# Altium schematic sheet STM32F429_minimum_system.SchDoc: STM32F429_minimum_system
size A3; Date: 2018/10/8; Author: WangPeirong; Revision: V1.1; SheetNumber: 2; SheetTotal: STM32F429IGT6 minimun system schdoc; Size: A3; Pages: 6
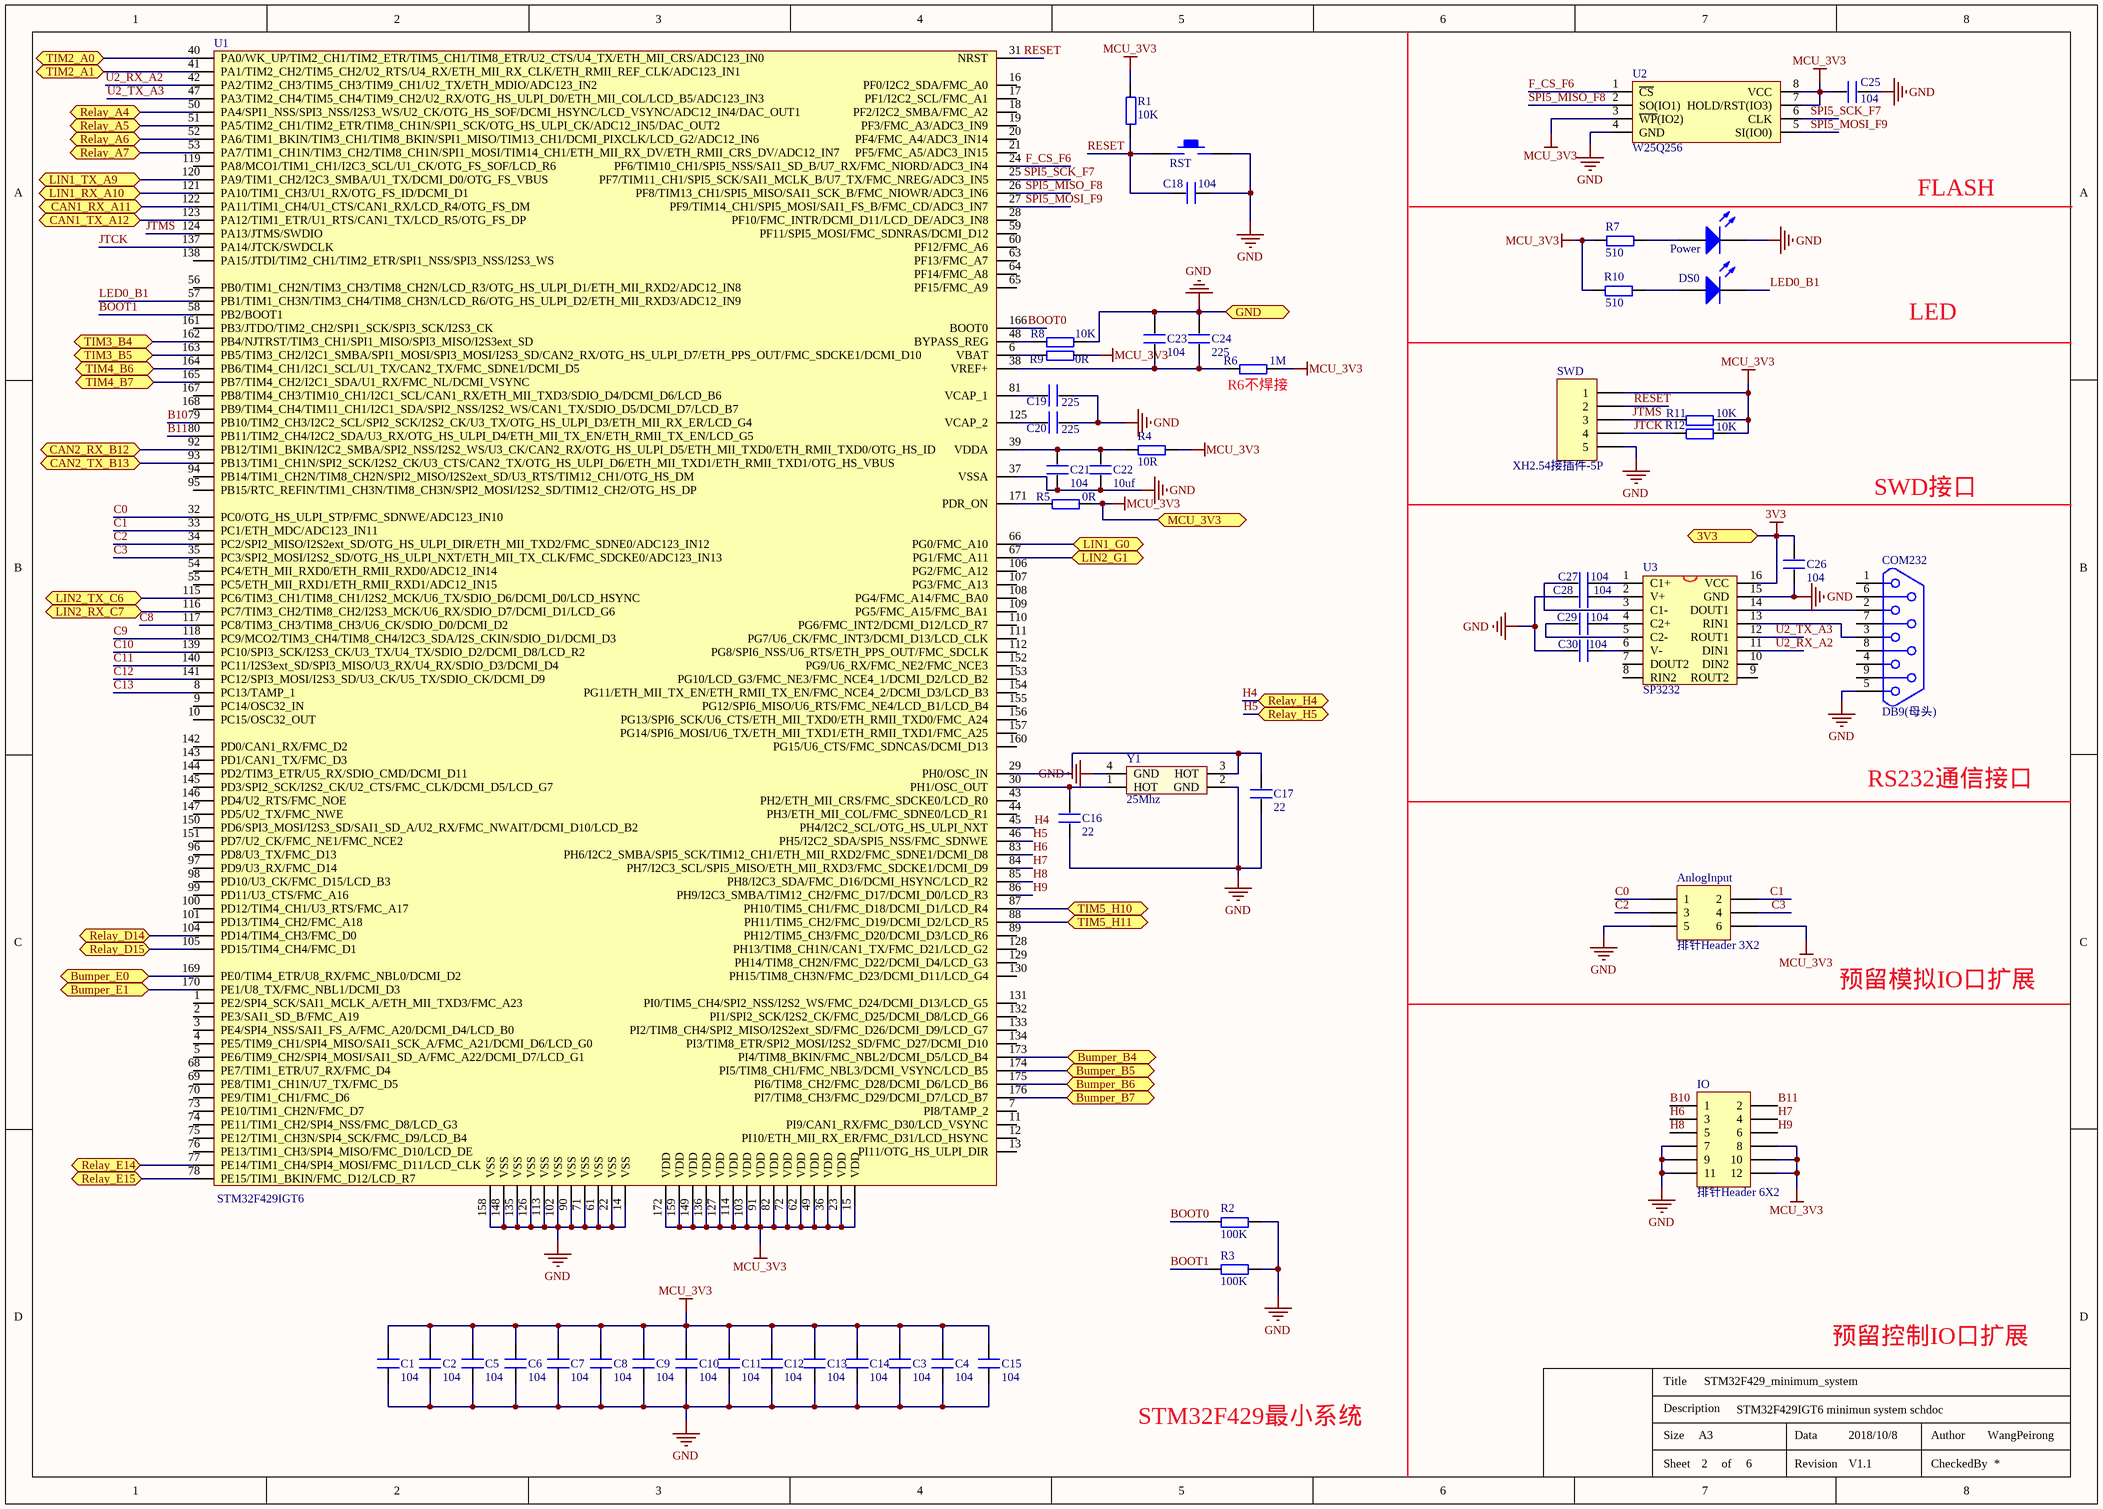
[diagram p0: STM32F429_minimum_system.SchDoc]

## Parts
AnlogInput  排针Header 3X2  [F-HEADER-2*3-2.54MM]
C1  104  [0603P]
C2  104  [0603P]
C3  104  [0603P]
C4  104  [0603P]
C5  104  [0603P]
C6  104  [0603P]
C7  104  [0603P]
C8  104  [0603P]
C9  104  [0603P]
C10  104  [0603P]
C11  104  [0603P]
C12  104  [0603P]
C13  104  [0603P]
C14  104  [0603P]
C15  104  [0603P]
C16  22  [0603P]
C17  22  [0603P]
C18  104  [0603P]
C19  225  [0603P]
C20  225  [0603P]
C21  104  [0603P]
C22  10uf  [0603P]
C23  104  [0603P]
C24  225  [0603P]
C25  104  [0603P]
C26  104  [0603P]
C27  104  [0603P]
C28  104  [0603P]
C29  104  [0603P]
C30  104  [0603P]
COM232  DB9(母头)  [DB9]
DS0  LED绿色  [SMDLED]  (value not drawn)
IO  排针Header 6X2  [F-HEADER-2*6-2.54MM]
Power  LED红色  [SMDLED]  (value not drawn)
R1  10K  [0603P]
R2  100K  [0603P]
R3  100K  [0603P]
R4  10R  [0603P]
R5  0R  [0603P]
R6  1M  [0603P]
R7  510  [0603P]
R8  10K  [0603P]
R9  0R  [0603P]
R10  510  [0603P]
R11  10K  [0603P]
R12  10K  [0603P]
RST  KEY_M  [KEY_SOP3625]  (value not drawn)
SWD  XH2.54接插件-5P  [F-HEADER-5-2.54MM]
U1  STM32F429IGT6  [LQFP176]
U2  W25Q256  [WSON8]
U3  SP3232  [SOP16M]
Y1  25Mhz  [XTAL3225]

## Ports
3V3, Bumper_B4, Bumper_B5, Bumper_B6, Bumper_B7, Bumper_E0, Bumper_E1, CAN1_RX_A11, CAN1_TX_A12, CAN2_RX_B12, CAN2_TX_B13, GND, LIN1_G0, LIN1_RX_A10, LIN1_TX_A9, LIN2_G1, LIN2_RX_C7, LIN2_TX_C6, MCU_3V3, Relay_A4, Relay_A5, Relay_A6, Relay_A7, Relay_D14, Relay_D15, Relay_E14, Relay_E15, Relay_H4, Relay_H5, TIM2_A0, TIM2_A1, TIM3_B4, TIM3_B5, TIM4_B6, TIM4_B7, TIM5_H10, TIM5_H11

## Nets
3V3: C26.2 U3.16(VCC) ; port 3V3
GND: AnlogInput.5 C1.1 C2.1 C3.1 C4.1 C5.1 C6.1 C7.1 C8.1 C9.1 C10.1 C11.1 C12.1 C13.1 C14.1 C15.1 C16.2 C17.2 C18.2 C19.2 C20.2 C21.1 C22.1 C23.2 C24.2 C25.2 C26.1 C28.2 C30.2 COM232.5 IO.7 IO.9 IO.11 Power.2(K) R2.2 R3.2 R8.2 RST.2 SWD.5 U1.14(VSS) U1.22(VSS) U1.37(VSSA) U1.61(VSS) U1.71(VSS) U1.90(VSS) U1.102(VSS) U1.113(VSS) U1.126(VSS) U1.135(VSS) U1.148(VSS) U1.158(VSS) U2.4(GND) U3.15(GND) Y1.2(GND) Y1.4(GND) ; port GND
MCU_3V3: AnlogInput.6 C1.2 C2.2 C3.2 C4.2 C5.2 C6.2 C7.2 C8.2 C9.2 C10.2 C11.2 C12.2 C13.2 C14.2 C15.2 C25.1 IO.8 IO.10 IO.12 R1.2 R4.2 R5.2 R6.2 R7.1 R9.2 R10.1 R11.2 R12.2 SWD.1 U1.15(VDD) U1.23(VDD) U1.36(VDD) U1.49(VDD) U1.62(VDD) U1.72(VDD) U1.82(VDD) U1.91(VDD) U1.103(VDD) U1.114(VDD) U1.127(VDD) U1.136(VDD) U1.149(VDD) U1.159(VDD) U1.172(VDD) U2.3(~{WP}(IO2)) U2.7(HOLD/RST(IO3)) U2.8(VCC) ; port MCU_3V3
B10: IO.1 U1.79(PB10/TIM2_CH3/I2C2_SCL/SPI2_SCK/I2S2_CK/U3_TX/OTG_HS_ULPI_D3/ETH_MII_RX_ER/LCD_G4)
B11: IO.2 U1.80(PB11/TIM2_CH4/I2C2_SDA/U3_RX/OTG_HS_ULPI_D4/ETH_MII_TX_EN/ETH_RMII_TX_EN/LCD_G5)
BOOT0: R2.1 U1.166(BOOT0)
BOOT1: R3.1 U1.58(PB2/BOOT1)
Bumper_B4: U1.173(PI4/TIM8_BKIN/FMC_NBL2/DCMI_D5/LCD_B4) ; port Bumper_B4
Bumper_B5: U1.174(PI5/TIM8_CH1/FMC_NBL3/DCMI_VSYNC/LCD_B5) ; port Bumper_B5
Bumper_B6: U1.175(PI6/TIM8_CH2/FMC_D28/DCMI_D6/LCD_B6) ; port Bumper_B6
Bumper_B7: U1.176(PI7/TIM8_CH3/FMC_D29/DCMI_D7/LCD_B7) ; port Bumper_B7
Bumper_E0: U1.169(PE0/TIM4_ETR/U8_RX/FMC_NBL0/DCMI_D2) ; port Bumper_E0
Bumper_E1: U1.170(PE1/U8_TX/FMC_NBL1/DCMI_D3) ; port Bumper_E1
C0: AnlogInput.1 U1.32(PC0/OTG_HS_ULPI_STP/FMC_SDNWE/ADC123_IN10)
C1: AnlogInput.2 U1.33(PC1/ETH_MDC/ADC123_IN11)
C2: AnlogInput.3 U1.34(PC2/SPI2_MISO/I2S2ext_SD/OTG_HS_ULPI_DIR/ETH_MII_TXD2/FMC_SDNE0/ADC123_IN12)
C3: AnlogInput.4 U1.35(PC3/SPI2_MOSI/I2S2_SD/OTG_HS_ULPI_NXT/ETH_MII_TX_CLK/FMC_SDCKE0/ADC123_IN13)
C8: U1.117(PC8/TIM3_CH3/TIM8_CH3/U6_CK/SDIO_D0/DCMI_D2)
C9: U1.118(PC9/MCO2/TIM3_CH4/TIM8_CH4/I2C3_SDA/I2S_CKIN/SDIO_D1/DCMI_D3)
C10: U1.139(PC10/SPI3_SCK/I2S3_CK/U3_TX/U4_TX/SDIO_D2/DCMI_D8/LCD_R2)
C11: U1.140(PC11/I2S3ext_SD/SPI3_MISO/U3_RX/U4_RX/SDIO_D3/DCMI_D4)
C12: U1.141(PC12/SPI3_MOSI/I2S3_SD/U3_CK/U5_TX/SDIO_CK/DCMI_D9)
C13: U1.8(PC13/TAMP_1)
CAN1_RX_A11: U1.122(PA11/TIM1_CH4/U1_CTS/CAN1_RX/LCD_R4/OTG_FS_DM) ; port CAN1_RX_A11
CAN1_TX_A12: U1.123(PA12/TIM1_ETR/U1_RTS/CAN1_TX/LCD_R5/OTG_FS_DP) ; port CAN1_TX_A12
CAN2_RX_B12: U1.92(PB12/TIM1_BKIN/I2C2_SMBA/SPI2_NSS/I2S2_WS/U3_CK/CAN2_RX/OTG_HS_ULPI_D5/ETH_MII_TXD0/ETH_RMII_TXD0/OTG_HS_ID) ; port CAN2_RX_B12
CAN2_TX_B13: U1.93(PB13/TIM1_CH1N/SPI2_SCK/I2S2_CK/U3_CTS/CAN2_TX/OTG_HS_ULPI_D6/ETH_MII_TXD1/ETH_RMII_TXD1/OTG_HS_VBUS) ; port CAN2_TX_B13
F_CS_F6: U1.24(PF6/TIM10_CH1/SPI5_NSS/SAI1_SD_B/U7_RX/FMC_NIORD/ADC3_IN4) U2.1(~{CS})
H4: U1.45(PH4/I2C2_SCL/OTG_HS_ULPI_NXT) ; port Relay_H4
H5: U1.46(PH5/I2C2_SDA/SPI5_NSS/FMC_SDNWE) ; port Relay_H5
H6: IO.3 U1.83(PH6/I2C2_SMBA/SPI5_SCK/TIM12_CH1/ETH_MII_RXD2/FMC_SDNE1/DCMI_D8)
H7: IO.4 U1.84(PH7/I2C3_SCL/SPI5_MISO/ETH_MII_RXD3/FMC_SDCKE1/DCMI_D9)
H8: IO.5 U1.85(PH8/I2C3_SDA/FMC_D16/DCMI_HSYNC/LCD_R2)
H9: IO.6 U1.86(PH9/I2C3_SMBA/TIM12_CH2/FMC_D17/DCMI_D0/LCD_R3)
JTCK: R12.1 SWD.4 U1.137(PA14/JTCK/SWDCLK)
JTMS: R11.1 SWD.3 U1.124(PA13/JTMS/SWDIO)
LED0_B1: DS0.2(K) U1.57(PB1/TIM1_CH3N/TIM3_CH4/TIM8_CH3N/LCD_R6/OTG_HS_ULPI_D2/ETH_MII_RXD3/ADC12_IN9)
LIN1_G0: U1.66(PG0/FMC_A10) ; port LIN1_G0
LIN1_RX_A10: U1.121(PA10/TIM1_CH3/U1_RX/OTG_FS_ID/DCMI_D1) ; port LIN1_RX_A10
LIN1_TX_A9: U1.120(PA9/TIM1_CH2/I2C3_SMBA/U1_TX/DCMI_D0/OTG_FS_VBUS) ; port LIN1_TX_A9
LIN2_G1: U1.67(PG1/FMC_A11) ; port LIN2_G1
LIN2_RX_C7: U1.116(PC7/TIM3_CH2/TIM8_CH2/I2S3_MCK/U6_RX/SDIO_D7/DCMI_D1/LCD_G6) ; port LIN2_RX_C7
LIN2_TX_C6: U1.115(PC6/TIM3_CH1/TIM8_CH1/I2S2_MCK/U6_TX/SDIO_D6/DCMI_D0/LCD_HSYNC) ; port LIN2_TX_C6
Relay_A4: U1.50(PA4/SPI1_NSS/SPI3_NSS/I2S3_WS/U2_CK/OTG_HS_SOF/DCMI_HSYNC/LCD_VSYNC/ADC12_IN4/DAC_OUT1) ; port Relay_A4
Relay_A5: U1.51(PA5/TIM2_CH1/TIM2_ETR/TIM8_CH1N/SPI1_SCK/OTG_HS_ULPI_CK/ADC12_IN5/DAC_OUT2) ; port Relay_A5
Relay_A6: U1.52(PA6/TIM1_BKIN/TIM3_CH1/TIM8_BKIN/SPI1_MISO/TIM13_CH1/DCMI_PIXCLK/LCD_G2/ADC12_IN6) ; port Relay_A6
Relay_A7: U1.53(PA7/TIM1_CH1N/TIM3_CH2/TIM8_CH1N/SPI1_MOSI/TIM14_CH1/ETH_MII_RX_DV/ETH_RMII_CRS_DV/ADC12_IN7) ; port Relay_A7
Relay_D14: U1.104(PD14/TIM4_CH3/FMC_D0) ; port Relay_D14
Relay_D15: U1.105(PD15/TIM4_CH4/FMC_D1) ; port Relay_D15
Relay_E14: U1.77(PE14/TIM1_CH4/SPI4_MOSI/FMC_D11/LCD_CLK) ; port Relay_E14
Relay_E15: U1.78(PE15/TIM1_BKIN/FMC_D12/LCD_R7) ; port Relay_E15
RESET: C18.1 R1.1 RST.1 SWD.2 U1.31(NRST)
SPI5_MISO_F8: U1.26(PF8/TIM13_CH1/SPI5_MISO/SAI1_SCK_B/FMC_NIOWR/ADC3_IN6) U2.2(SO(IO1))
SPI5_MOSI_F9: U1.27(PF9/TIM14_CH1/SPI5_MOSI/SAI1_FS_B/FMC_CD/ADC3_IN7) U2.5(SI(IO0))
SPI5_SCK_F7: U1.25(PF7/TIM11_CH1/SPI5_SCK/SAI1_MCLK_B/U7_TX/FMC_NREG/ADC3_IN5) U2.6(CLK)
TIM2_A0: U1.40(PA0/WK_UP/TIM2_CH1/TIM2_ETR/TIM5_CH1/TIM8_ETR/U2_CTS/U4_TX/ETH_MII_CRS/ADC123_IN0) ; port TIM2_A0
TIM2_A1: U1.41(PA1/TIM2_CH2/TIM5_CH2/U2_RTS/U4_RX/ETH_MII_RX_CLK/ETH_RMII_REF_CLK/ADC123_IN1) ; port TIM2_A1
TIM3_B4: U1.162(PB4/NJTRST/TIM3_CH1/SPI1_MISO/SPI3_MISO/I2S3ext_SD) ; port TIM3_B4
TIM3_B5: U1.163(PB5/TIM3_CH2/I2C1_SMBA/SPI1_MOSI/SPI3_MOSI/I2S3_SD/CAN2_RX/OTG_HS_ULPI_D7/ETH_PPS_OUT/FMC_SDCKE1/DCMI_D10) ; port TIM3_B5
TIM4_B6: U1.164(PB6/TIM4_CH1/I2C1_SCL/U1_TX/CAN2_TX/FMC_SDNE1/DCMI_D5) ; port TIM4_B6
TIM4_B7: U1.165(PB7/TIM4_CH2/I2C1_SDA/U1_RX/FMC_NL/DCMI_VSYNC) ; port TIM4_B7
TIM5_H10: U1.87(PH10/TIM5_CH1/FMC_D18/DCMI_D1/LCD_R4) ; port TIM5_H10
TIM5_H11: U1.88(PH11/TIM5_CH2/FMC_D19/DCMI_D2/LCD_R5) ; port TIM5_H11
U2_RX_A2: U1.42(PA2/TIM2_CH3/TIM5_CH3/TIM9_CH1/U2_TX/ETH_MDIO/ADC123_IN2) U3.11(DIN1)
U2_TX_A3: U1.47(PA3/TIM2_CH4/TIM5_CH4/TIM9_CH2/U2_RX/OTG_HS_ULPI_D0/ETH_MII_COL/LCD_B5/ADC123_IN3) U3.12(ROUT1)
NetC16_1: C16.1 U1.30(PH1/OSC_OUT) Y1.1(HOT)
NetC17_1: C17.1 U1.29(PH0/OSC_IN) Y1.3(HOT)
NetC19_1: C19.1 U1.81(VCAP_1)
NetC20_1: C20.1 U1.125(VCAP_2)
NetC21_2: C21.2 C22.2 R4.1 U1.39(VDDA)
NetC23_1: C23.1 C24.1 R6.1 U1.38(VREF+)
NetC27_1: C27.1 U3.1(C1+)
NetC27_2: C27.2 U3.3(C1-)
NetC28_1: C28.1 U3.2(V+)
NetC29_1: C29.1 U3.4(C2+)
NetC29_2: C29.2 U3.5(C2-)
NetC30_1: C30.1 U3.6(V-)
NetCOM232_2: COM232.2 U3.14(DOUT1)
NetCOM232_3: COM232.3 U3.13(RIN1)
NetDS0_1: DS0.1(A) R10.2
NetPower_1: Power.1(A) R7.2
NetR5_1: R5.1 U1.171(PDR_ON)
NetR8_1: R8.1 U1.48(BYPASS_REG)
NetR9_1: R9.1 U1.6(VBAT)

Not connected (* = marked no-connect by the designer): COM232 1 4 6 7 8 9; U1 1(PE2/SPI4_SCK/SAI1_MCLK_A/ETH_MII_TXD3/FMC_A23) 2(PE3/SAI1_SD_B/FMC_A19) 3(PE4/SPI4_NSS/SAI1_FS_A/FMC_A20/DCMI_D4/LCD_B0) 4(PE5/TIM9_CH1/SPI4_MISO/SAI1_SCK_A/FMC_A21/DCMI_D6/LCD_G0) 5(PE6/TIM9_CH2/SPI4_MOSI/SAI1_SD_A/FMC_A22/DCMI_D7/LCD_G1) 7(PI8/TAMP_2) 9(PC14/OSC32_IN) 10(PC15/OSC32_OUT) 11(PI9/CAN1_RX/FMC_D30/LCD_VSYNC) 12(PI10/ETH_MII_RX_ER/FMC_D31/LCD_HSYNC) 13(PI11/OTG_HS_ULPI_DIR) 16(PF0/I2C2_SDA/FMC_A0) 17(PF1/I2C2_SCL/FMC_A1) 18(PF2/I2C2_SMBA/FMC_A2) 19(PF3/FMC_A3/ADC3_IN9) 20(PF4/FMC_A4/ADC3_IN14) 21(PF5/FMC_A5/ADC3_IN15) 28(PF10/FMC_INTR/DCMI_D11/LCD_DE/ADC3_IN8) 43(PH2/ETH_MII_CRS/FMC_SDCKE0/LCD_R0) 44(PH3/ETH_MII_COL/FMC_SDNE0/LCD_R1) 54(PC4/ETH_MII_RXD0/ETH_RMII_RXD0/ADC12_IN14) 55(PC5/ETH_MII_RXD1/ETH_RMII_RXD1/ADC12_IN15) 56(PB0/TIM1_CH2N/TIM3_CH3/TIM8_CH2N/LCD_R3/OTG_HS_ULPI_D1/ETH_MII_RXD2/ADC12_IN8) 59(PF11/SPI5_MOSI/FMC_SDNRAS/DCMI_D12) 60(PF12/FMC_A6) 63(PF13/FMC_A7) 64(PF14/FMC_A8) 65(PF15/FMC_A9) 68(PE7/TIM1_ETR/U7_RX/FMC_D4) 69(PE8/TIM1_CH1N/U7_TX/FMC_D5) 70(PE9/TIM1_CH1/FMC_D6) 73(PE10/TIM1_CH2N/FMC_D7) 74(PE11/TIM1_CH2/SPI4_NSS/FMC_D8/LCD_G3) 75(PE12/TIM1_CH3N/SPI4_SCK/FMC_D9/LCD_B4) 76(PE13/TIM1_CH3/SPI4_MISO/FMC_D10/LCD_DE) 89(PH12/TIM5_CH3/FMC_D20/DCMI_D3/LCD_R6) 94(PB14/TIM1_CH2N/TIM8_CH2N/SPI2_MISO/I2S2ext_SD/U3_RTS/TIM12_CH1/OTG_HS_DM) 95(PB15/RTC_REFIN/TIM1_CH3N/TIM8_CH3N/SPI2_MOSI/I2S2_SD/TIM12_CH2/OTG_HS_DP) 96(PD8/U3_TX/FMC_D13) 97(PD9/U3_RX/FMC_D14) 98(PD10/U3_CK/FMC_D15/LCD_B3) 99(PD11/U3_CTS/FMC_A16) 100(PD12/TIM4_CH1/U3_RTS/FMC_A17) 101(PD13/TIM4_CH2/FMC_A18) 106(PG2/FMC_A12) 107(PG3/FMC_A13) 108(PG4/FMC_A14/FMC_BA0) 109(PG5/FMC_A15/FMC_BA1) 110(PG6/FMC_INT2/DCMI_D12/LCD_R7) 111(PG7/U6_CK/FMC_INT3/DCMI_D13/LCD_CLK) 112(PG8/SPI6_NSS/U6_RTS/ETH_PPS_OUT/FMC_SDCLK) 119(PA8/MCO1/TIM1_CH1/I2C3_SCL/U1_CK/OTG_FS_SOF/LCD_R6) 128(PH13/TIM8_CH1N/CAN1_TX/FMC_D21/LCD_G2) 129(PH14/TIM8_CH2N/FMC_D22/DCMI_D4/LCD_G3) 130(PH15/TIM8_CH3N/FMC_D23/DCMI_D11/LCD_G4) 131(PI0/TIM5_CH4/SPI2_NSS/I2S2_WS/FMC_D24/DCMI_D13/LCD_G5) 132(PI1/SPI2_SCK/I2S2_CK/FMC_D25/DCMI_D8/LCD_G6) 133(PI2/TIM8_CH4/SPI2_MISO/I2S2ext_SD/FMC_D26/DCMI_D9/LCD_G7) 134(PI3/TIM8_ETR/SPI2_MOSI/I2S2_SD/FMC_D27/DCMI_D10) 138(PA15/JTDI/TIM2_CH1/TIM2_ETR/SPI1_NSS/SPI3_NSS/I2S3_WS) 142(PD0/CAN1_RX/FMC_D2) 143(PD1/CAN1_TX/FMC_D3) 144(PD2/TIM3_ETR/U5_RX/SDIO_CMD/DCMI_D11) 145(PD3/SPI2_SCK/I2S2_CK/U2_CTS/FMC_CLK/DCMI_D5/LCD_G7) 146(PD4/U2_RTS/FMC_NOE) 147(PD5/U2_TX/FMC_NWE) 150(PD6/SPI3_MOSI/I2S3_SD/SAI1_SD_A/U2_RX/FMC_NWAIT/DCMI_D10/LCD_B2) 151(PD7/U2_CK/FMC_NE1/FMC_NCE2) 152(PG9/U6_RX/FMC_NE2/FMC_NCE3) 153(PG10/LCD_G3/FMC_NE3/FMC_NCE4_1/DCMI_D2/LCD_B2) 154(PG11/ETH_MII_TX_EN/ETH_RMII_TX_EN/FMC_NCE4_2/DCMI_D3/LCD_B3) 155(PG12/SPI6_MISO/U6_RTS/FMC_NE4/LCD_B1/LCD_B4) 156(PG13/SPI6_SCK/U6_CTS/ETH_MII_TXD0/ETH_RMII_TXD0/FMC_A24) 157(PG14/SPI6_MOSI/U6_TX/ETH_MII_TXD1/ETH_RMII_TXD1/FMC_A25) 160(PG15/U6_CTS/FMC_SDNCAS/DCMI_D13) 161(PB3/JTDO/TIM2_CH2/SPI1_SCK/SPI3_SCK/I2S3_CK) 167(PB8/TIM4_CH3/TIM10_CH1/I2C1_SCL/CAN1_RX/ETH_MII_TXD3/SDIO_D4/DCMI_D6/LCD_B6) 168(PB9/TIM4_CH4/TIM11_CH1/I2C1_SDA/SPI2_NSS/I2S2_WS/CAN1_TX/SDIO_D5/DCMI_D7/LCD_B7); U3 7(DOUT2) 8(RIN2) 9(ROUT2) 10(DIN2)

## Notes on the sheet
- FLASH
- LED
- (near R6) R6不焊接
- SWD接口
- RS232通信接口
- 预留模拟IO口扩展
- 预留控制IO口扩展
- STM32F429最小系统
- Title
- Description
- Size
- Data
- Author
- Sheet
- of
- Revision
- CheckedBy

## Library data of the parts
AnlogInput = Header 3X2: Header, 3-Pin, Dual row; LatestRevisionDate: 17-Jul-2002; LatestRevisionNote: Re-released for DXP Platform.; Publisher: Altium Limited
C1-C30 = C
COM232 = DB9
DS0 Power = LED2: Typical RED, GREEN, YELLOW, AMBER GaAs LED; Published: 8-Jun-2000; LatestRevisionDate: 17-Jul-2002; LatestRevisionNote: Re-released for DXP Platform.; PackageDocument: Feb-2002; PackageReference: 3.2X1.6X1.1; Publisher: Altium Limited
IO = Header 6X2: Header, 6-Pin, Dual row; LatestRevisionDate: 17-Jul-2002; LatestRevisionNote: Re-released for DXP Platform.; Publisher: Altium Limited
R1-R12 = R
SWD = Header 5: Header, 5-Pin; LatestRevisionDate: 17-Jul-2002; LatestRevisionNote: Re-released for DXP Platform.; Publisher: Altium Limited
U2 = W25Q128
U3 = MAX3232
Y1 = XTAL_3225: 3225贴片无源晶振